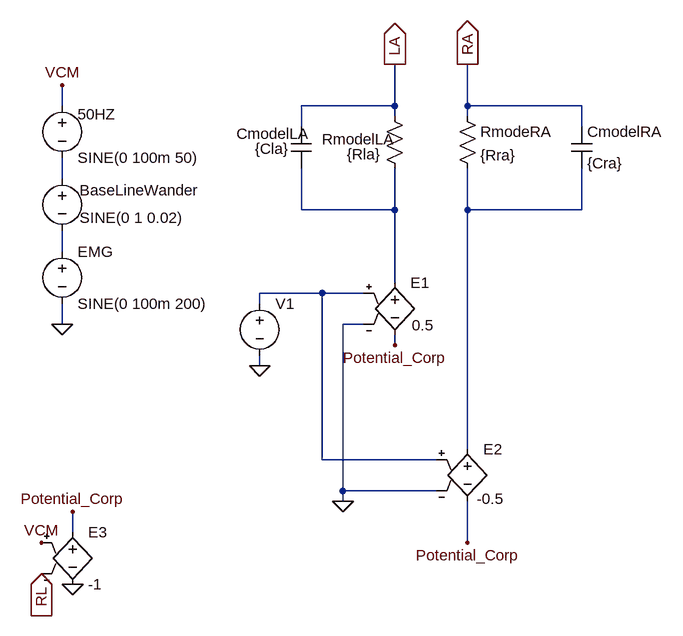
[diagram p0: schematic Electrozi.asc]
Electrozi.asc, the LTspice schematic file:
Version 4.1
SHEET 1 880 680
WIRE -352 -432 -352 -464
WIRE 160 -432 160 -496
WIRE 160 -432 16 -432
WIRE 272 -432 272 -496
WIRE 448 -432 272 -432
WIRE 160 -416 160 -432
WIRE 272 -416 272 -432
WIRE 16 -400 16 -432
WIRE 448 -400 448 -432
WIRE -352 -320 -352 -352
WIRE 16 -272 16 -336
WIRE 160 -272 160 -336
WIRE 160 -272 16 -272
WIRE 272 -272 272 -336
WIRE 448 -272 448 -336
WIRE 448 -272 272 -272
WIRE -352 -208 -352 -240
WIRE 160 -160 160 -272
WIRE 48 -144 -48 -144
WIRE 112 -144 48 -144
WIRE -48 -128 -48 -144
WIRE -352 -96 -352 -128
WIRE 112 -96 80 -96
WIRE 160 -64 160 -80
WIRE -48 -32 -48 -48
WIRE 272 96 272 -272
WIRE 48 112 48 -144
WIRE 224 112 48 112
WIRE 80 160 80 -96
WIRE 224 160 80 160
WIRE 80 176 80 160
WIRE -336 224 -336 192
WIRE 272 240 272 176
FLAG -48 -32 0
FLAG 80 176 0
FLAG -352 -464 VCM
FLAG 160 -64 Potential_Corp
FLAG 272 240 Potential_Corp
FLAG 160 -496 LA
IOPIN 160 -496 Out
FLAG 272 -496 RA
IOPIN 272 -496 Out
FLAG -336 192 Potential_Corp
FLAG -336 304 0
FLAG -384 240 VCM
FLAG -384 288 RL
IOPIN -384 288 In
FLAG -352 -96 0
SYMBOL e 160 -176 R0
WINDOW 3 26 81 Left 2
SYMATTR Value 0.5
SYMATTR InstName E1
SYMBOL e 272 80 R0
WINDOW 3 14 92 Left 2
SYMATTR Value -0.5
SYMATTR InstName E2
SYMBOL voltage -48 -144 R0
WINDOW 3 -863 149 Invisible 2
WINDOW 123 0 0 Left 0
WINDOW 39 0 0 Left 0
SYMATTR Value PWL file=C:\Users\botaa\Documents\Licenta\AchizitionareSemnal\ekg_signal2.txt
SYMATTR InstName V1
SYMBOL voltage -352 -448 R0
WINDOW 0 24 29 Left 2
SYMATTR InstName 50HZ
SYMATTR Value SINE(0 100m 50)
SYMBOL voltage -352 -336 R0
WINDOW 0 27 34 Left 2
WINDOW 3 27 76 Left 2
WINDOW 123 0 0 Left 0
WINDOW 39 0 0 Left 0
SYMATTR InstName BaseLineWander
SYMATTR Value SINE(0 1 0.02)
SYMBOL res 256 -432 R0
SYMATTR InstName RmodeRA
SYMATTR Value {Rra}
SYMBOL res 144 -432 R0
WINDOW 0 -96 51 Left 2
WINDOW 3 -58 74 Left 2
SYMATTR InstName RmodelLA
SYMATTR Value {Rla}
SYMBOL cap 0 -400 R0
WINDOW 0 -84 11 Left 2
WINDOW 3 -55 34 Left 2
SYMATTR InstName CmodelLA
SYMATTR Value {Cla}
SYMBOL cap 432 -400 R0
SYMATTR InstName CmodelRA
SYMATTR Value {Cra}
SYMBOL voltage -352 -224 R0
SYMATTR InstName EMG
SYMATTR Value SINE(0 100m 200)
SYMBOL e -336 208 R0
SYMATTR InstName E3
SYMATTR Value -1

The netlist it stands for:
* Electrozi.asc
E1 N002 Potential_Corp N005 0 0.5
E2 N003 Potential_Corp N005 0 -0.5
V1 N005 0 PWL file=C:\Users\botaa\Documents\Licenta\AchizitionareSemnal\ekg_signal2.txt
V§50HZ VCM N001 SINE(0 100m 50)
V§BaseLineWander N001 N004 SINE(0 1 0.02)
RmodeRA RA N003 {Rra}
RmodelLA LA N002 {Rla}
CmodelLA LA N002 {Cla}
CmodelRA RA N003 {Cra}
V§EMG N004 0 SINE(0 100m 200)
E3 Potential_Corp 0 VCM RL -1
.backanno
.end